# Altium schematic sheet SoC.SchDoc
size A4
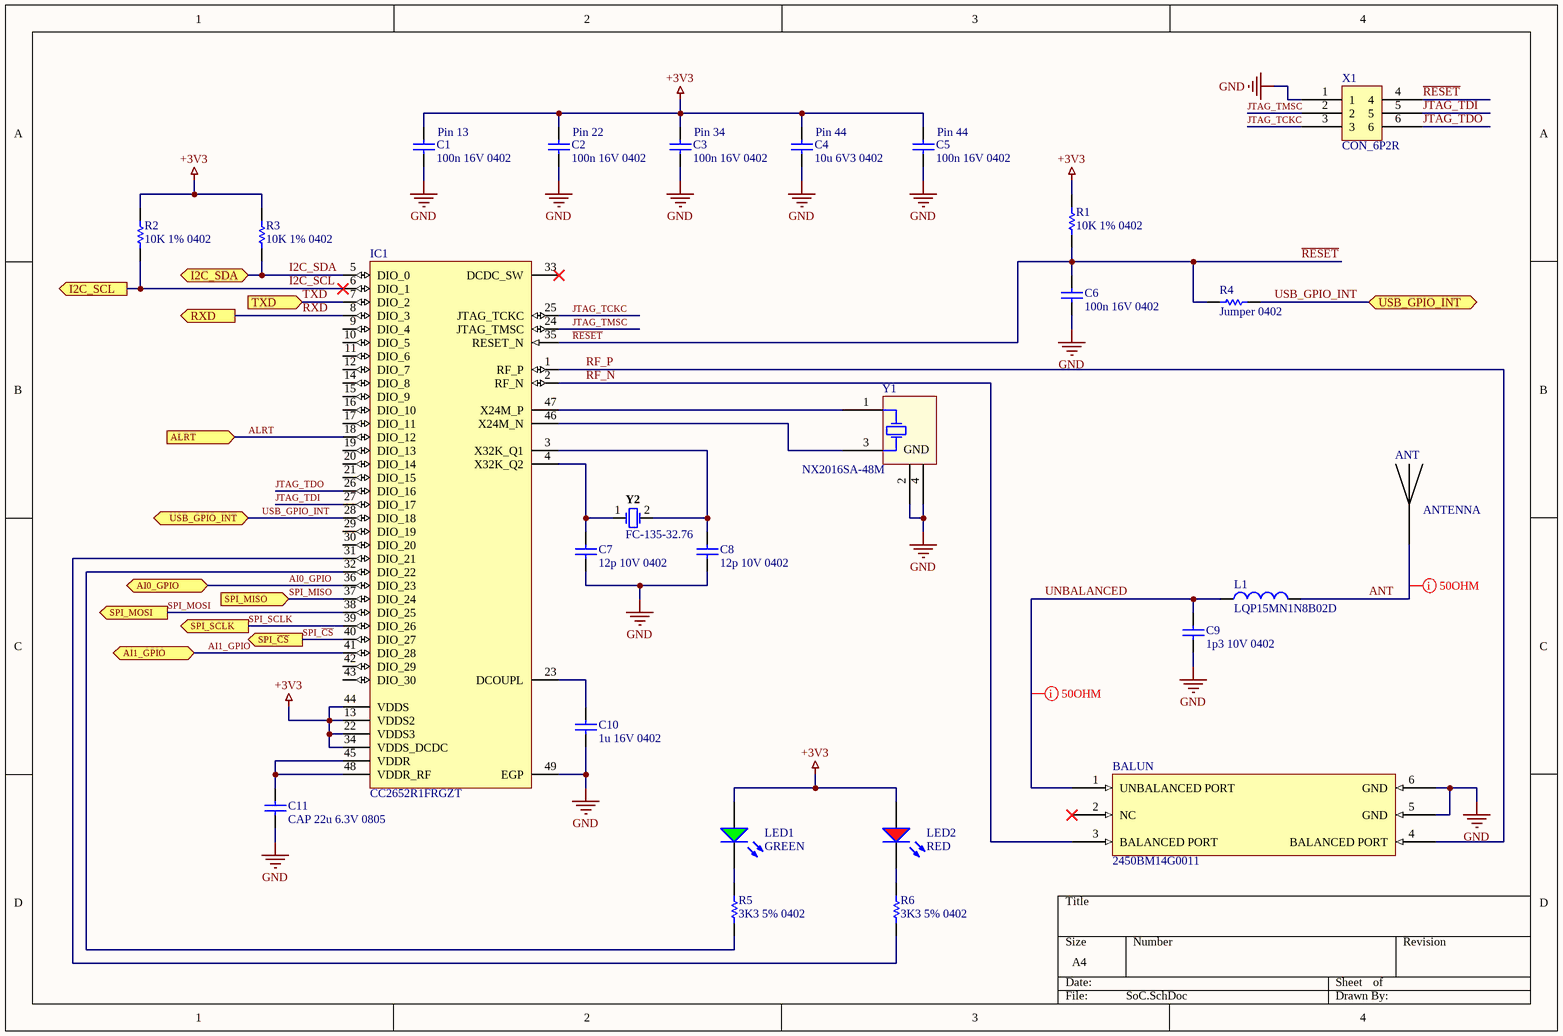
[diagram p0: SoC.SchDoc]

## Parts
ANT  ANTENNA  [MOLEX_47948-0001]
BALUN  2450BM14G0011  [SON50P80X70-6L]
C1  100n 16V 0402  [CAPC0402(1005)60_L]
C2  100n 16V 0402  [CAPC0402(1005)60_L]
C3  100n 16V 0402  [CAPC0402(1005)60_L]
C4  10u 6V3 0402  [CAPC0402(1005)60_L]
C5  100n 16V 0402  [CAPC0402(1005)60_L]
C6  100n 16V 0402  [CAPC0402(1005)60_L]
C7  12p 10V 0402  [CAPC0402(1005)60_L]
C8  12p 10V 0402  [CAPC0402(1005)60_L]
C9  1p3 10V 0402  [CAPC0402(1005)60_M]
C10  1u 16V 0402  [CAPC0402(1005)60_N]
C11  CAP 22u 6.3V 0805  [CAPC0805(2012)145_L]
IC1  CC2652R1FRGZT  [RGZ0048A_V]
L1  LQP15MN1N8B02D  [INDC1005X45X25ML10T10]
LED1  GREEN  [LED_0402]
LED2  RED  [LED_0402]
R1  10K 1% 0402  [RESC0402(1005)_L]
R2  10K 1% 0402  [RESC0402(1005)_L]
R3  10K 1% 0402  [RESC0402(1005)_L]
R4  Jumper 0402  [RESC0402(1005)_L]
R5  3K3 5% 0402  [RESC0402(1005)_L]
R6  3K3 5% 0402  [RESC0402(1005)_L]
X1  CON_6P2R  [JTAG_Con]
Y1  NX2016SA-48M  [Crystal_2016]
Y2  FC-135-32.76  [EPSON-FC-135_V]

## Ports
AI0_GPIO (bidir), AI1_GPIO (bidir), ALRT (in), I2C_SCL (out), I2C_SDA (bidir), RXD (out), SPI_MISO (in), SPI_MOSI (out), SPI_SCLK (out), SPI_~{CS} (out), TXD (in), USB_GPIO_INT (bidir)

## Nets
+3V3: C1.2 C2.2 C3.2 C4.2 C5.2 IC1.13(VDDS2) IC1.22(VDDS3) IC1.34(VDDS_DCDC) IC1.44(VDDS) LED1.ANODE LED2.ANODE R1.2 R2.2 R3.2
GND: BALUN.5(GND) BALUN.6(GND) C1.1 C2.1 C3.1 C4.1 C5.1 C6.1 C7.1 C8.1 C9.1 C10.1 C11.1 IC1.49(EGP) X1.1 Y1.2(GND) Y1.4(GND)
AI0_GPIO: IC1.36(DIO_23) ; port AI0_GPIO
AI1_GPIO: IC1.41(DIO_28) ; port AI1_GPIO
ALRT: IC1.18(DIO_12) ; port ALRT
ANT: ANT.ANTENNA L1.2
I2C_SCL: IC1.6(DIO_1) R2.1 ; port I2C_SCL
I2C_SDA: IC1.5(DIO_0) R3.1 ; port I2C_SDA
JTAG_TCKC: IC1.25(JTAG_TCKC) X1.3
JTAG_TDI: IC1.27(DIO_17) X1.5
JTAG_TDO: IC1.26(DIO_16) X1.6
JTAG_TMSC: IC1.24(JTAG_TMSC) X1.2
~{RESET}: C6.2 IC1.35(RESET_N) R1.1 R4.1 X1.4
RF_N: BALUN.3(BALANCED_PORT) IC1.2(RF_N)
RF_P: BALUN.4(BALANCED_PORT) IC1.1(RF_P)
RXD: IC1.8(DIO_3) ; port RXD
SPI_~{CS}: IC1.40(DIO_27) ; port SPI_~{CS}
SPI_MISO: IC1.37(DIO_24) ; port SPI_MISO
SPI_MOSI: IC1.38(DIO_25) ; port SPI_MOSI
SPI_SCLK: IC1.39(DIO_26) ; port SPI_SCLK
TXD: IC1.7(DIO_2) ; port TXD
UNBALANCED: BALUN.1(UNBALANCED_PORT) C9.2 L1.1
USB_GPIO_INT: IC1.28(DIO_18) R4.2 ; port USB_GPIO_INT
NetC7_2: C7.2 IC1.4(X32K_Q2) Y2.1
NetC8_2: C8.2 IC1.3(X32K_Q1) Y2.2
NetC10_2: C10.2 IC1.23(DCOUPL)
NetC11_2: C11.2 IC1.45(VDDR) IC1.48(VDDR_RF)
NetIC1_31: IC1.31(DIO_21) R6.1
NetIC1_32: IC1.32(DIO_22) R5.1
NetIC1_46: IC1.46(X24M_N) Y1.3(X2)
NetIC1_47: IC1.47(X24M_P) Y1.1(X1)
NetLED1_CATHODE: LED1.CATHODE R5.2
NetLED2_CATHODE: LED2.CATHODE R6.2

Not connected (* = marked no-connect by the designer): BALUN 2(NC)*; IC1 9(DIO_4) 10(DIO_5) 11(DIO_6) 12(DIO_7) 14(DIO_8) 15(DIO_9) 16(DIO_10) 17(DIO_11) 19(DIO_13) 20(DIO_14) 21(DIO_15) 29(DIO_19) 30(DIO_20) 33(DCDC_SW)* 42(DIO_29) 43(DIO_30)

## Layout directives
rule Impedance Constraint [Min = 45.00    Max = 55.00    ]; net class S50: ANT, UNBALANCED

## Notes on the sheet
- (near C1) Pin 13
- (near C2) Pin 22
- (near C3) Pin 34
- (near C4) Pin 44
- (near C5) Pin 44

## Library data of the parts
C1-C3 C5 C6 = CMP-1034-02069-1: CAP 100nF 16V ±10% 0402 (1005 Metric) Thickness 0.6mm SMD; Case-EIA: 0402; Case-Metric: 1005; Tolerance: Â±10%; Value: 100nF; Max Thickness: 0.6 mm; Rated Voltage: 16 V; Technology: SMT
C4 = CMP-1034-02138-1: CAP 10uF 6.3V ±20% 0402 (1005 Metric) Thickness 0.6mm SMD; Case-Metric: 1005; Case-EIA: 0402; Tolerance: Â±20%; Rated Voltage: 6.3 V; Technology: SMT; Max Thickness: 0.6 mm; Value: 10uF
C7 C8 = CMP-1034-00749-1: CAP 12pF 10V ±1% 0402 (1005 Metric) Thickness 0.6mm SMD; Tolerance: Â±1%; Case-EIA: 0402; Case-Metric: 1005; Technology: SMT; Max Thickness: 0.6 mm; Value: 12pF; Rated Voltage: 10 V
C9 = CMP-1034-00089-1: CAP 1.3pF 10V ±0.25pF 0402 (1005 Metric) Thickness 0.6mm SMD; Case-EIA: 0402; Tolerance: Â±0.25pF; Case-Metric: 1005; Max Thickness: 0.6 mm; Value: 1.3pF; Rated Voltage: 10 V; Technology: SMT
C10 = CMP-1034-02119-1: CAP 1uF 16V ±10% 0402 (1005 Metric) Thickness 0.6mm SMD; Case-EIA: 0402; Tolerance: Â±10%; Case-Metric: 1005; Technology: SMT; Rated Voltage: 16 V; Max Thickness: 0.6 mm; Value: 1uF
C11 = CMP-1036-04938-1: CAP 22uF 6.3V ±10% 0805 (2012 Metric) Thickness 1.45mm SMD; Tolerance: Â±10%; Case-EIA: 0805; Case-Metric: 2012; Technology: SMT; Rated Voltage: 6.3 V; Max Thickness: 1.45 mm; Value: 22uF
IC1 = CMP-2000-06080-1: CC2650 SimpleLink(TM) Multistandard Wireless MCU, 1.8 to 3.8 V, -40 to 85 degC, 48-Pin VFQFN, Green (RoHS & no Sb/Br), Tape and Reel; Manufacturer: Texas Instruments; Minimum Operating Supply Voltage: 1.8V; Maximum Operating Supply Voltage: 3.8V; Maximum Speed: 48MHz; Lead Finish: GoldOverNickelPalladium; Screening Level: Industrial; Program Memory Size: 128KB; Max Processing Temp: 260; Operating Supply Voltage: 2.5; RAM Size: 30KB; Operating Temperature: -40to85C; Datasheet URL: http://www.ti.com/lit/ds/symlink/cc2650.pdf; Manufacturer URL: http://www.ti.com/; Datasheet Version: Rev. B, 07/2016; Category: MicrocontrollerTools; Package Description: 48-Pin Quad Flat No-lead Package, Body 7 x 7 mm, Pitch 0.5 mm; Package Reference: RGZ0048A; Mounting Technology: SurfaceMount; Mounting: SurfaceMount
L1 = CMP-2000-06590-1: Chip Inductor, 1.8 nH, +/- 0.1 nH, 280 mA, -40 to 85 degC, 0402 (1005 Metric), RoHS, Tape and Reel; Manufacturer: Murata; DC Resistance: 0.2O; Tolerance (nH): ±0.1nH; Rated Current-Max: 280mA; Inductance-Nom: 1.8nH; Manufacturer URL: http://www.murata.com/; Mounting Technology: SurfaceMount; Datasheet URL: http://search.murata.co.jp/Ceramy/image/img/PDF/ENG/L0075S0084LQP15M.pdf; Datasheet Version: 09/2010; Package Reference: 0402; Case Size/Dimension: 0402; Package Description: 2-Pin Surface Mount Device, Body 1 x 0.5 mm
LED1 LED2 = LED: Generic 0402 LED
R1-R3 = CMP-1011-00623-1: 10K 0.063W 1% 0402 (1005 Metric)  SMD; Case-Metric: 1005; Value: 10000.00 Ohm; Case-EIA: 0402; Tolerance: 1 %; Technology: SMT; Power: 0.063 W
R4 = CMP-1011-00001-1: Jumper 0402 (1005 Metric); Tolerance: None; Case-Metric: 1005; Case-EIA: 0402; Value: 0.00 Ohm; Power: None; Technology: SMT
R5 R6 = CMP-1011-00086-1: 3K3 0.063W 5% 0402 (1005 Metric)  SMD; Case-EIA: 0402; Value: 3300.00 Ohm; Case-Metric: 1005; Power: 0.063 W; Technology: SMT; Tolerance: 5 %
Y1 = NX2016SA
Y2 = CMP-2100-03637-1: Crystal Unit, 32 to 77.5 KHz, 0.5 uW, -40 to 85 degC, 2-Pin SMD, RoHS; Manufacturer: Epson; RoHSCompliant: false; Datasheet URL: http://www5.epsondevice.com/en/products/khz_range/fc135r.html#; Datasheet Version: 42036.0; Manufacturer URL: https://www.eea.epson.com/; Package Reference: FC-135; Package Description: 2-Pin Surface Mount Device, Body 3.2 x 1.5 mm